# Altium schematic sheet MCU.SchDoc: Title
size A4; Date: *******; ApprovedBy: *******; CheckedBy: Yasiru Banayake; Author: *******; CompanyName: *******; DrawnBy: Name; Engineer: *******; Organization: *******; Address1: *******; Address2: *******; Address3: *******; Address4: *******; DocumentNumber: Doc Num; Revision: *******; SheetNumber: 11; SheetTotal: 11; Subtitle: MCU; Project: Resturant Robot; VersionRevision: III; TotalSheet: 11; CurrentTime: *******; CurrentDate: *******; Time: *******; DocumentFullPathAndName: *******; DocumentName: *******; ModifiedDate: *******; ImagePath: *******; ProjectName: *******; Application_BuildNumber: *******
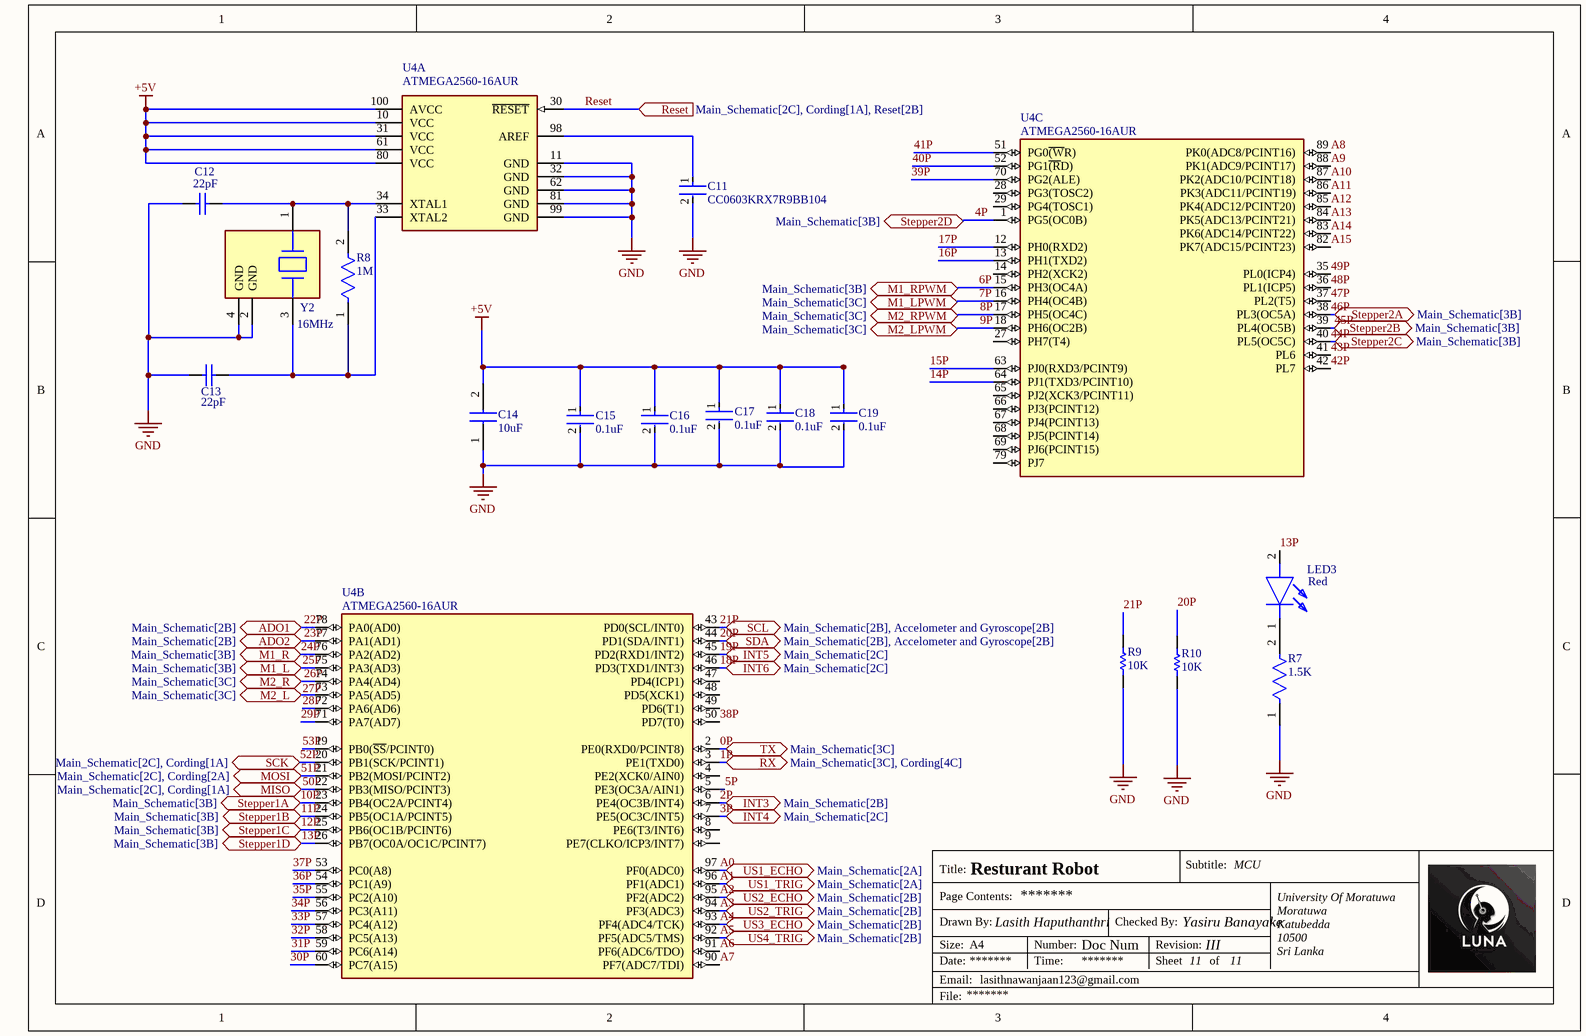
[diagram p0: MCU.SchDoc]

## Parts
C11  CC0603KRX7R9BB104  [FP-CC0603-DA-MFG]
C12  22pF  [CAPC1608X90X40LL10T20]
C13  22pF  [CAPC1608X90X40LL10T20]
C14  10uF  [CAPC1608X90N]
C15  0.1uF  [FP-CC0603-DA-MFG]
C16  0.1uF  [FP-CC0603-DA-MFG]
C17  0.1uF  [FP-CC0603-DA-MFG]
C18  0.1uF  [FP-CC0603-DA-MFG]
C19  0.1uF  [FP-CC0603-DA-MFG]
LED3  Red  [LEDC1608X55N]
R7  1.5K  [FP-AF0603-IPC_B]
R8  1M  [FP-AF0603-IPC_B]
R9  10K  [RESC1608X55X25ML10T15]
R10  10K  [RESC1608X55X25ML10T15]
U4  ATMEGA2560-16AUR  [FP-100A-MFG]  (parts A,B,C of 3)
Y2  16MHz  [FP-ABM8G-MFG]

## Ports
ADO1 (bidir, see Main_Schematic[2B]), ADO2 (bidir, see Main_Schematic[2B]), INT3 (bidir, see Main_Schematic[2B]), INT4 (bidir, see Main_Schematic[2C]), INT5 (bidir, see Main_Schematic[2C]), INT6 (bidir, see Main_Schematic[2C]), M1_L (bidir, see Main_Schematic[3B]), M1_LPWM (bidir, see Main_Schematic[3C]), M1_R (bidir, see Main_Schematic[3B]), M1_RPWM (bidir, see Main_Schematic[3B]), M2_L (bidir, see Main_Schematic[3C]), M2_LPWM (bidir, see Main_Schematic[3C]), M2_R (bidir, see Main_Schematic[3C]), M2_RPWM (bidir, see Main_Schematic[3C]), MISO (bidir, see Main_Schematic[2C], Cording[1A]), MOSI (bidir, see Main_Schematic[2C], Cording[2A]), Reset (in, see Main_Schematic[2C], Cording[1A], Reset[2B]), RX (bidir, see Main_Schematic[3C], Cording[4C]), SCK (bidir, see Main_Schematic[2C], Cording[1A]), SCL (bidir, see Main_Schematic[2B], Accelometer and Gyroscope[2B]), SDA (bidir, see Main_Schematic[2B], Accelometer and Gyroscope[2B]), Stepper1A (bidir, see Main_Schematic[3B]), Stepper1B (bidir, see Main_Schematic[3B]), Stepper1C (bidir, see Main_Schematic[3B]), Stepper1D (bidir, see Main_Schematic[3B]), Stepper2A (bidir, see Main_Schematic[3B]), Stepper2B (bidir, see Main_Schematic[3B]), Stepper2C (bidir, see Main_Schematic[3B]), Stepper2D (bidir, see Main_Schematic[3B]), TX (bidir, see Main_Schematic[3C]), US1_ECHO (bidir, see Main_Schematic[2A]), US1_TRIG (bidir, see Main_Schematic[2A]), US2_ECHO (bidir, see Main_Schematic[2B]), US2_TRIG (bidir, see Main_Schematic[2B]), US3_ECHO (bidir, see Main_Schematic[2B]), US4_TRIG (bidir, see Main_Schematic[2B])

## Nets
+5V: C14.2 C15.1 C16.1 C17.1 C18.1 C19.1 U4.10(VCC) U4.31(VCC) U4.61(VCC) U4.80(VCC) U4.100(AVCC)
GND: C11.2 C12.1 C13.1 C14.1 C15.2 C16.2 C17.2 C18.2 C19.2 R7.1 R9.1 R10.1 U4.11(GND) U4.32(GND) U4.62(GND) U4.81(GND) U4.99(GND) Y2.2(GND) Y2.4(GND)
0P: U4.2(PE0(RXD0/PCINT8)) ; port TX
1P: U4.3(PE1(TXD0)) ; port RX
2P: U4.6(PE4(OC3B/INT4)) ; port INT3
3P: U4.7(PE5(OC3C/INT5)) ; port INT4
4P: U4.1(PG5(OC0B)) ; port Stepper2D
5P: U4.5(PE3(OC3A/AIN1))
6P: U4.15(PH3(OC4A)) ; port M1_RPWM
7P: U4.16(PH4(OC4B)) ; port M1_LPWM
8P: U4.17(PH5(OC4C)) ; port M2_RPWM
9P: U4.18(PH6(OC2B)) ; port M2_LPWM
10P: U4.23(PB4(OC2A/PCINT4)) ; port Stepper1A
11P: U4.24(PB5(OC1A/PCINT5)) ; port Stepper1B
12P: U4.25(PB6(OC1B/PCINT6)) ; port Stepper1C
13P: LED3.2(A) U4.26(PB7(OC0A/OC1C/PCINT7)) ; port Stepper1D
14P: U4.64(PJ1(TXD3/PCINT10))
15P: U4.63(PJ0(RXD3/PCINT9))
16P: U4.13(PH1(TXD2))
17P: U4.12(PH0(RXD2))
18P: U4.46(PD3(TXD1/INT3)) ; port INT6
19P: U4.45(PD2(RXD1/INT2)) ; port INT5
20P: R10.2 U4.44(PD1(SDA/INT1)) ; port SDA
21P: R9.2 U4.43(PD0(SCL/INT0)) ; port SCL
22P: U4.78(PA0(AD0)) ; port ADO1
23P: U4.77(PA1(AD1)) ; port ADO2
24P: U4.76(PA2(AD2)) ; port M1_R
25P: U4.75(PA3(AD3)) ; port M1_L
26P: U4.74(PA4(AD4)) ; port M2_R
28P: U4.72(PA6(AD6))
29P: U4.71(PA7(AD7))
30P: U4.60(PC7(A15))
31P: U4.59(PC6(A14))
32P: U4.58(PC5(A13))
33P: U4.57(PC4(A12))
34P: U4.56(PC3(A11))
35P: U4.55(PC2(A10))
36P: U4.54(PC1(A9))
37P: U4.53(PC0(A8))
38P: U4.50(PD7(T0))
39P: U4.70(PG2(ALE))
40P: U4.52(PG1~{(R}D))
41P: U4.51(PG0~{(W}R))
42P: U4.42(PL7)
43P: U4.41(PL6)
44P: U4.40(PL5(OC5C)) ; port Stepper2C
45P: U4.39(PL4(OC5B)) ; port Stepper2B
46P: U4.38(PL3(OC5A)) ; port Stepper2A
47P: U4.37(PL2(T5))
48P: U4.36(PL1(ICP5))
49P: U4.35(PL0(ICP4))
50P: U4.22(PB3(MISO/PCINT3)) ; port MISO
51P: U4.21(PB2(MOSI/PCINT2)) ; port MOSI
52P: U4.20(PB1(SCK/PCINT1)) ; port SCK
53P: U4.19(PB0(~{SS}/PCINT0))
A0: U4.97(PF0(ADC0)) ; port US1_ECHO
A1: U4.96(PF1(ADC1)) ; port US1_TRIG
A2: U4.95(PF2(ADC2)) ; port US2_ECHO
A3: U4.94(PF3(ADC3)) ; port US2_TRIG
A4: U4.93(PF4(ADC4/TCK)) ; port US3_ECHO
A5: U4.92(PF5(ADC5/TMS)) ; port US4_TRIG
A6: U4.91(PF6(ADC6/TDO))
A7: U4.90(PF7(ADC7/TDI))
A8: U4.89(PK0(ADC8/PCINT16))
A9: U4.88(PK1(ADC9/PCINT17))
A10: U4.87(PK2(ADC10/PCINT18))
A11: U4.86(PK3(ADC11/PCINT19))
A12: U4.85(PK4(ADC12/PCINT20))
A13: U4.84(PK5(ADC13/PCINT21))
A14: U4.83(PK6(ADC14/PCINT22))
A15: U4.82(PK7(ADC15/PCINT23))
M2_L: U4.73(PA5(AD5)) ; port M2_L
Reset: U4.30(~{RESET}) ; port Reset
NetC11_1: C11.1 U4.98(AREF)
NetC12_2: C12.2 R8.2 U4.34(XTAL1) Y2.1
NetC13_2: C13.2 R8.1 U4.33(XTAL2) Y2.3
NetLED3_1: LED3.1(K) R7.2

Not connected (* = marked no-connect by the designer): U4 4(PE2(XCK0/AIN0)) 8(PE6(T3/INT6)) 9(PE7(CLKO/ICP3/INT7)) 14(PH2(XCK2)) 27(PH7(T4)) 28(PG3(TOSC2)) 29(PG4(TOSC1)) 47(PD4(ICP1)) 48(PD5(XCK1)) 49(PD6(T1)) 65(PJ2(XCK3/PCINT11)) 66(PJ3(PCINT12)) 67(PJ4(PCINT13)) 68(PJ5(PCINT14)) 69(PJ6(PCINT15)) 79(PJ7)

## Notes on the sheet
- Labels drawn without touching a wire or pin: 27P
- Title:
- Drawn By:
- Page Contents:
- Checked By:
- Subtitle:
- University Of Moratuwa
- Moratuwa
- Size:
- Date:
- File:
- Email:
- A4
- lasithnawanjaan123@gmail.com
- Lasith Haputhanthri
- Number:
- Time:
- Revision:
- Sheet
- of
- Katubedda
- 10500
- Sri Lanka

## Library data of the parts
C11 = CMP-2100-03601-2: CAP CER 0.1UF 50V X7R 0603; Manufacturer: YAGEO; Material: Ceramic; Capacitance: 100 nF; Temperature Coefficient: 15%; Tolerance: 0.1; Value: 100 nF; Height: 0.9mm; Voltage: 50 V; ComponentLink2Description: Datasheet; Device Class L2: Capacitors; Temperature Range High: +125°C; Category: Cap; Footprint Url: http://www.yageo.com/exep/pages/download/literatures/UPY-C_GEN_24.pdf; ComponentLink2URL: http://www.yageo.com/documents/recent/UPY-GPHC_X7R_6.3V-to-50V_18.pdf; Package: CC0603-DA; Temperature: -55°C to +125°C; Voltage Rating: 50 V; Temperature Characteristic: X7R; Device Class L1: Passive Components; Temperature Range Low: -55°C; Manufacturer Part Number: CC0603KRX7R9BB104; RoHS: TRUE; Automotive: No; Device Class L3: Ceramic Capacitors; Octopart: https://octopart.com/cc0603krx7r9bb104-yageo-42244635; Mouser Description: Multilayer Ceramic Capacitor, CC Series, 0.1 - F, - 10%, X7R, 50 V, 0603 [1608 Metric]; Lead Free: Yes; Digikey Description: CAP CER 0.1UF 50V X7R 0603
C12 C13 = CMP-1659-00026-1: CC0603JRNPO9BN220 Chip Capacitor, 22 pF, +/- 5%, 50 V, -55 to 125 degC, 0603 (1608 Metric), RoHS, Tape and Reel; ComponentLink1URL: http://www.yageo.com/; PackageReference: 0603; ComponentLink1Description: Manufacturer URL; PackageDescription: 2-Pin Surface Mount Device, Body 1.6 x 0.8 mm; DatasheetVersion: Rev. 8, 08/2011; ComponentLink2Description: Datasheet; ComponentLink2URL: http://www.yageo.com/documents/recent/UPY-GP_NP0_16V-to-50V_8.pdf
C14 = CL10A106KP8NNNC: CL10A106KP8NNNC Capacitor; Manufacturer_Name: SAMSUNG; Datasheet Link: https://datasheet.datasheetarchive.com/originals/distributors/Datasheets-DGA10/2415998.pdf; Height: 0.9mm; Manufacturer_Part_Number: CL10A106KP8NNNC; Mouser Part Number: 187-CL10A106KP8NNNC; Mouser Price/Stock: https://www.mouser.co.uk/ProductDetail/Samsung-Electro-Mechanics/CL10A106KP8NNNC?qs=X6jEic%2FHinAlyfRHj7fKwg%3D%3D; Arrow Part Number: CL10A106KP8NNNC; Arrow Price/Stock: https://www.arrow.com/en/products/cl10a106kp8nnnc/samsung-electro-mechanics?region=europe
C15-C19 = CMP-2100-03601-2: CC0603KRX7R9BB104 CAP CER 0.1UF 50V X7R 0603; Manufacturer: YAGEO; Material: Ceramic; Capacitance: 100 nF; Temperature Coefficient: 15%; Tolerance: 0.1; Value: 100 nF; Height: 0.9mm; Voltage: 50 V; ComponentLink2Description: Datasheet; Device Class L2: Capacitors; Temperature Range High: +125°C; Category: Cap; Footprint Url: http://www.yageo.com/exep/pages/download/literatures/UPY-C_GEN_24.pdf; ComponentLink2URL: http://www.yageo.com/documents/recent/UPY-GPHC_X7R_6.3V-to-50V_18.pdf; Package: CC0603-DA; Temperature: -55°C to +125°C; Voltage Rating: 50 V; Temperature Characteristic: X7R; Device Class L1: Passive Components; Temperature Range Low: -55°C; Manufacturer Part Number: CC0603KRX7R9BB104; RoHS: TRUE; Automotive: No; Device Class L3: Ceramic Capacitors; Octopart: https://octopart.com/cc0603krx7r9bb104-yageo-42244635; Mouser Description: Multilayer Ceramic Capacitor, CC Series, 0.1 - F, - 10%, X7R, 50 V, 0603 [1608 Metric]; Lead Free: Yes; Digikey Description: CAP CER 0.1UF 50V X7R 0603
LED3 = LTST-C191KRKT: LED; Manufacturer_Name: Lite-On; Datasheet Link: http://www.mouser.com/ds/2/239/S_110_LTST-C191KRKT-539838.pdf; Height: 0.55mm; Manufacturer_Part_Number: LTST-C191KRKT; Mouser Part Number: 859-LTST-C191KRKT; Mouser Price/Stock: https://www.mouser.co.uk/ProductDetail/Lite-On/LTST-C191KRKT?qs=BAIUz4Y8PJBLfOhzue0q%252BA%3D%3D; Arrow Part Number: LTST-C191KRKT; Arrow Price/Stock: https://www.arrow.com/en/products/ltst-c191krkt/lite-on-technology?region=nac
R7 R8 = CMP-03412-043191-1: AF0603FR-071K5L Anti-Sulfurated Chip Resistors Automotive Grade 1.5kΩ 1% 100ppm/°C 0603; Resistance: 1.5kR; Max Power Dissipation: 100mW; Length: 0.063inch; Packaging: Tape and Reel; Tolerance: 1%; RoHS Compliant: Yes; Series: AF; Temperature Coefficient: 100ppm/°C; Case/Package: 0603; Height: 0.022inch; Min Operating Temperature: -55°C; Resistor Type: Thick Film; Features: Moisture Resistant; Width: 0.031inch; Number of Terminations: 2; Max Operating Temperature: 155°C
R9 R10 = CMP-2000-05022-1: RC0603JR-0710KL Resistor, 10 KOhm, +/- 5%, 100 mW, -55 to 155 degC, 0603 (1608 Metric), RoHS, Tape and Reel; Manufacturer: Yageo; Resistance: 10kOhms; Voltage Rating: 50V; Temperature Coefficient: 100PPM/C; Power Rating: 100mW; Package Reference: 603; Series: RC; Case Code - mm: 1608; Packaging: Reel; Datasheet URL: http://www.farnell.com/datasheets/443971.pdf; Datasheet Version: Rev. 4, 04/2009; Operating Temperature Range: -55Cto+155C; Product: ThickFilmResistorsGeneralPurpose; Package Description: 2-Pin Surface Mount Device, Body 1.6 x 0.8 mm; Manufacturer URL: http://www.yageo.com/; Case Code - in: 0603; Tolerance: 5%; Termination Style: SMD/SMT
U4 = CMP-06276-000073-1: IC MCU 8BIT 256KB FLASH 100TQFP; Oscillator Type: External; Interface: UART; Memory Type: OTP; Memory Size: 8KB; Core Architecture: PIC; Peripherals: POR; Frequency: 16MHz; Number of I/Os: 33; Packaging: Rail/Tube; Max Operating Temperature: 70°C; Case/Package: DIP; Min Operating Temperature: 0°C
Y2 = CMP-2000-05039-3: ABM8G-16.000MHZ-18-D2Y-T Crystal 12MHz ±20ppm (Tol) ±30ppm (Stability) 18pF FUND 120Ω 4-Pin SMD T/R; Series Resistance: 120R; Max Operating Temperature: 85°C; Mount: Surface Mount; Width: 2.5mm; Series: ABM8G; Termination: SMD/SMT; Frequency Tolerance: 20ppm; Tolerance: 20ppm; Min Operating Temperature: -40°C; Operating Frequency: 12 MHz; Depth: 2.5mm; Load Capacitance: 18pF; Number of Pins: 4; Length: 3.2mm; Radiation Hardening: No; Frequency Stability: 30ppm; Height: 1mm; Packaging: Tape and Reel; Package Quantity: 1000; ESR (Equivalent Series Resistance): 120R; Lead Free: Lead Free; Frequency: 12MHz; Case/Package: CSMD